# EasyEDA Pro project ProDoc_PCB1_2025-12-06.epro

# Board PCB1
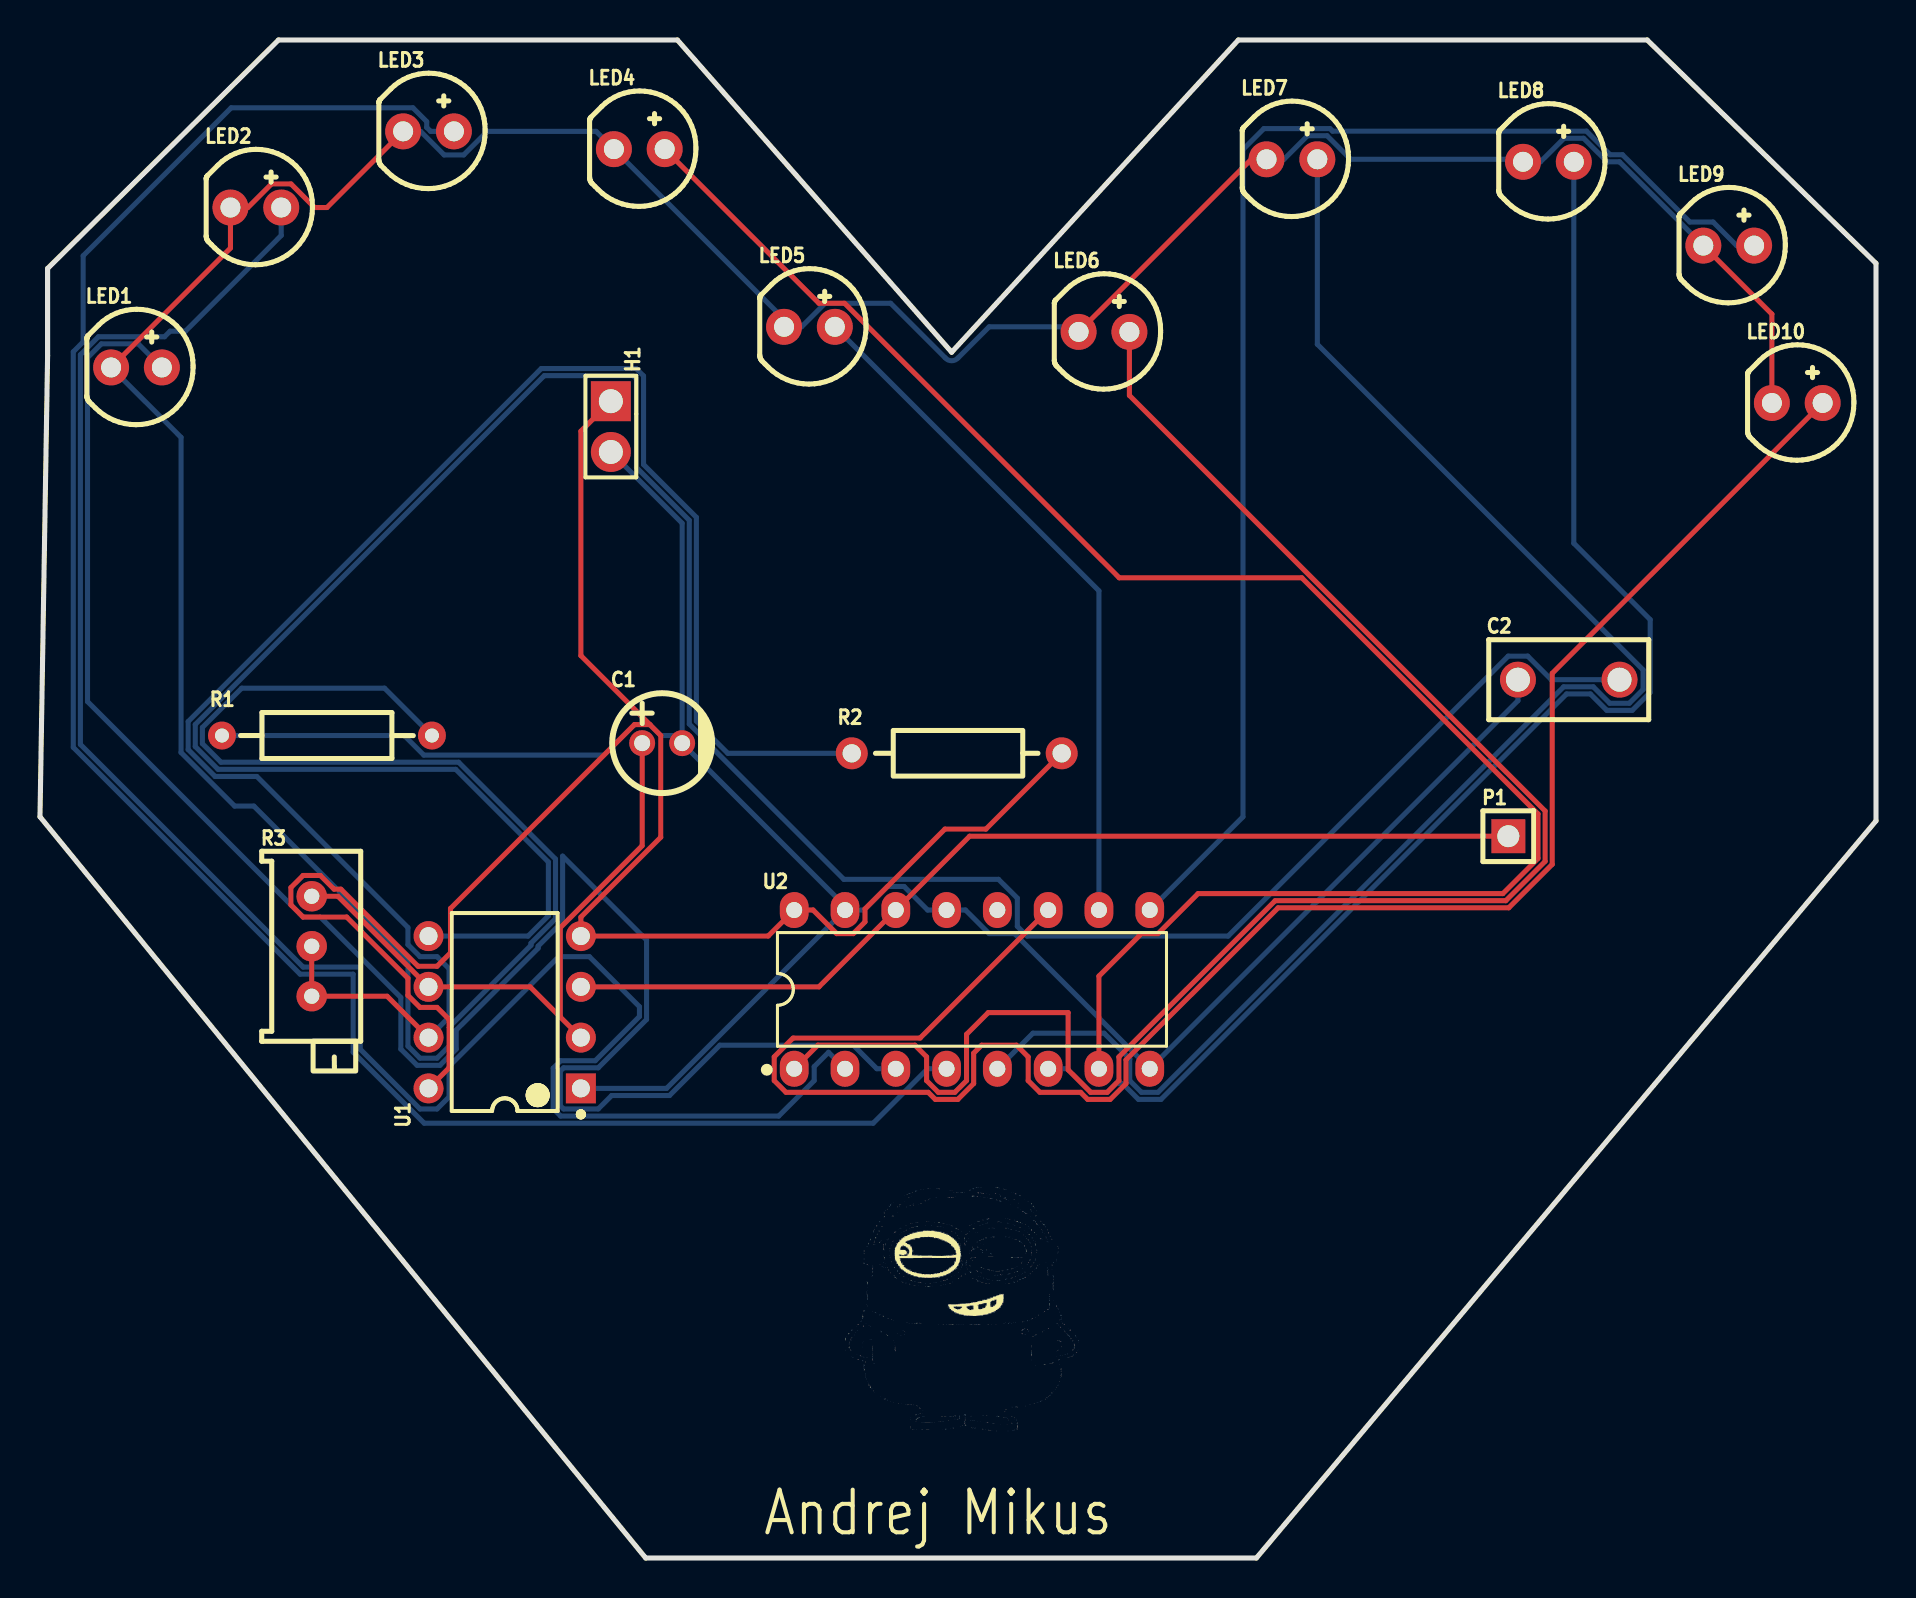
[diagram p0: board, top side]
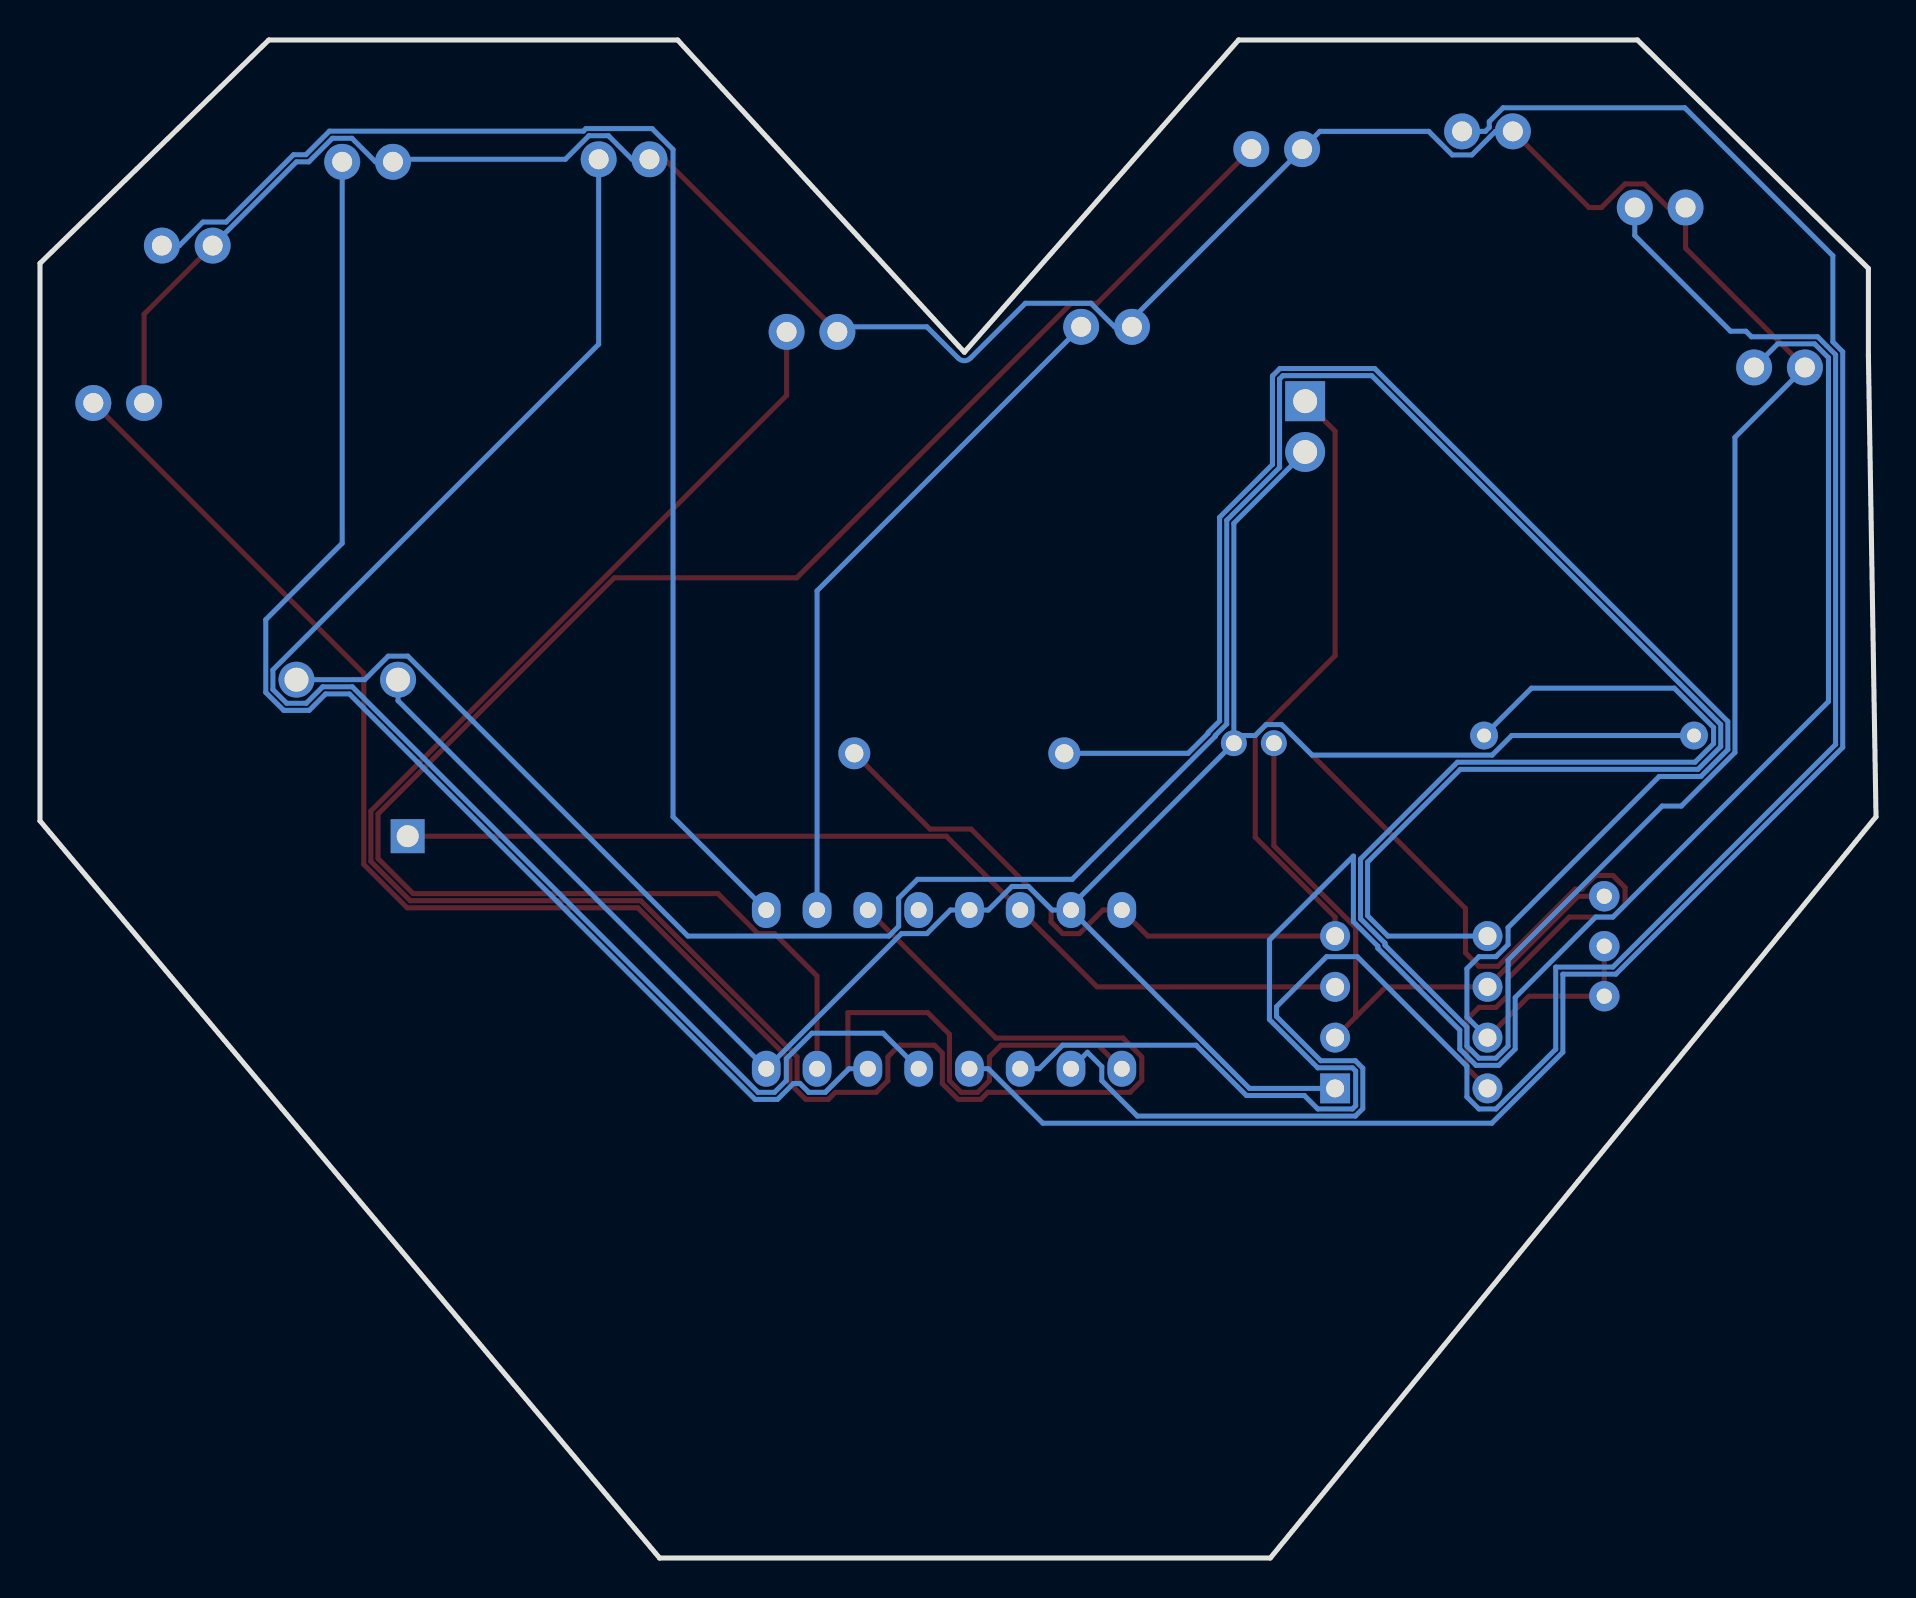
[diagram p1: board, bottom side, seen from below]

Outline 91.82 x 75.95 mm; copper layers: Top Layer, Bottom Layer. Coordinates in mm from the lower left corner of the outline.
Outline path: 0,37.08 30.29,0 60.83,0 91.82,36.88 91.82,64.77 80.38,75.95 59.93,75.95 45.59,60.33 31.88,75.95 11.93,75.95 0.38,64.52 0.38,60.16 0,37.08
Stack: Top Layer 0.035mm / Dielectric1 1.51mm FR4 er 4.5 / Bottom Layer 0.035mm

## Design rules (mm)
template: JLCPCB Capability(Two Layers Board)
spacing copperThickness1oz (default): track to track 0.102, other pairs 0.152 to 0.3
spacing copperThickness2oz: track to track 0.203, other pairs 0.152 to 0.3
track width copperThickness1oz (default): min 0.127, default 0.254, max 2.54
track width copperThickness2oz: min 0.203, default 0.254, max 2.54
differential pair differentialPair (default): width min 0.127, default 0.254, max 2.54; gap min 0.152, default 0.152
via viaSize (default): diameter min 0.5, default 0.61, max 10; hole min 0.3, default 0.305, max 6.3

## Placement (name value [footprint] x y rotation side)
C1  1uF  [CAP-TH_BD5.0-P2.00-D0.8-FD]  31.11 40.77 0 top
C2  10nF  [CAP-TH_L8.0-W4.0-P5.00-D1.2]  76.45 43.94 0 top
H1  PZ254V-11-02P  [HDR-TH_2P-P2.54-V-M]  28.55 56.6 270 top
LED1  LED1  [LED-TH_BD5.9-P2.54-RD_WHITE]  4.83 59.56 0 top
LED2  LED2  [LED-TH_BD5.9-P2.54-RD_WHITE]  10.8 67.56 0 top
LED3  LED3  [LED-TH_BD5.9-P2.54-RD_WHITE]  19.43 71.37 0 top
LED4  LED4  [LED-TH_BD5.9-P2.54-RD_WHITE]  29.97 70.49 0 top
LED5  LED5  [LED-TH_BD5.9-P2.54-RD_WHITE]  38.48 61.6 0 top
LED6  LED6  [LED-TH_BD5.9-P2.54-RD_WHITE]  53.21 61.34 0 top
LED7  LED7  [LED-TH_BD5.9-P2.54-RD_WHITE]  62.61 69.98 0 top
LED8  LED8  [LED-TH_BD5.9-P2.54-RD_WHITE]  75.44 69.85 0 top
LED9  LED9  [LED-TH_BD5.9-P2.54-RD_WHITE]  84.45 65.66 0 top
LED10  LED10  [LED-TH_BD5.9-P2.54-RD_WHITE]  87.88 57.79 0 top
P1  2.54-1*1P针  [HDR-TH_1P-P2.54-V-M]  73.43 36.11 0 top
R1  1kΩ  [RES-TH_BD2.3-L6.5-P10.50-D0.5]  14.35 41.15 0 top
R2  470Ω  [RES-TH_BD2.2-L6.5-P10.50-D0.6]  45.85 40.26 0 top
R3  50kΩ  [RES-ADJ-TH_3P-L9.5-W4.85-P2.50-BL-L]  13.59 30.61 0 top
U1  NE555P  [DIP-8_L9.8-W6.6-P2.54-LS7.6-BL]  23.24 27.31 90 top
U2  CD4017BE(LX)  [PDIP-16_L19.3-W6.4-P2.54-LS7.94-BL]  46.61 28.45 0 top

## Footprints (pads in the part's own frame, mm; a bottom-side part is the same pattern mirrored in y, then rotated)
CAP-TH_BD5.0-P2.00-D0.8-FD
  round 1.3 hole 0.8: 1(-1,0) 2(1,0)
CAP-TH_L8.0-W4.0-P5.00-D1.2
  round 1.8 hole 1.2: 1(-2.54,0) 2(2.54,0)
DIP-8_L9.8-W6.6-P2.54-LS7.6-BL
  rect 1.5x1.5 hole 0.9: 1(-3.81,-3.81)
  round 1.5 hole 0.9: 2(-1.27,-3.81) 3(1.27,-3.81) 4(3.81,-3.81) 5(3.81,3.81) 6(1.27,3.81) 7(-1.27,3.81) 8(-3.81,3.81)
HDR-TH_1P-P2.54-V-M
  rect 1.7x1.7 hole 1.1: 1(0,0)
HDR-TH_2P-P2.54-V-M
  rect 2x2 hole 1.2: 1(-1.27,0)
  round 2 hole 1.2: 2(1.27,0)
LED-TH_BD5.9-P2.54-RD_WHITE
  round 1.8 hole 1: 1(-1.27,0) 2(1.27,0)
PDIP-16_L19.3-W6.4-P2.54-LS7.94-BL
  oval 1.44x1.8 hole 0.8: 1(-8.89,-3.97) 2(-6.35,-3.97) 3(-3.81,-3.97) 4(-1.27,-3.97) 5(1.27,-3.97) 6(3.81,-3.97) 7(6.35,-3.97) 8(8.89,-3.97) 9(8.89,3.97) 10(6.35,3.97) 11(3.81,3.97) 12(1.27,3.97) 13(-1.27,3.97) 14(-3.81,3.97) 15(-6.35,3.97) 16(-8.89,3.97)
RES-ADJ-TH_3P-L9.5-W4.85-P2.50-BL-L
  round 1.524 hole 0.762: 1(0,2.5) 2(0,0) 3(0,-2.5)
RES-TH_BD2.2-L6.5-P10.50-D0.6
  round 1.6 hole 0.914: 1(-5.25,0) 2(5.25,0)
RES-TH_BD2.3-L6.5-P10.50-D0.5
  round 1.4 hole 0.7: 1(-5.25,0) 2(5.25,0)

## Nets
$1N1415: LED1.2 U2.3
$1N1443: LED2.2 U2.2
$1N1452: LED3.2 U2.4
$1N1462: LED4.2 U2.7
$1N1469: LED5.2 U2.10
$1N1474: LED6.2 U2.1
$1N1481: LED7.2 U2.5
$1N1488: LED8.2 U2.6
$1N1495: LED9.2 U2.9
$1N1502: LED10.2 U2.11
$1N1515: LED1.1 LED2.1 LED3.1 LED4.1 LED5.1 LED6.1 LED7.1 LED8.1 LED9.1 LED10.1 R1.2
$1N1669: H1.1 R2.2 U1.4 U1.8 U2.16
$1N1753: R2.1 R3.2 R3.3 U1.7
$1N1808: C1.1 R3.1 U1.2 U1.6
$1N1830: C2.2 U1.5
$1N2211: C1.2 C2.1 H1.2 R1.1 U1.1 U2.8 U2.13 U2.15
$1N2219: P1.1 U1.3 U2.14

Pads without a net: U2 12

## Routing (per net, layer and track width the routed paths; a pad name or vN(x,y) marks a point on that pad's centre or on a via; arc(x,y) is an arc through that point)
$1N1415: length 97.1
  Bottom Layer w0.254: LED1.2 4.92,60.74 3.07,60.74 2.38,60.05 2.38,42.85 13.16,32.07 14.02,32.07 18.05,28.04 18.05,25.46 18.86,24.65 20,24.65 20.82,25.46 20.82,26.41 24.91,30.51 24.91,30.61 26.14,31.84 26.14,35.12 30.33,30.92 30.33,26.94 27.92,24.52 26.19,24.52 26.02,24.36 26.02,22.63 26.19,22.47 27.92,22.47 28.59,23.14 31.48,23.14 34,25.66 40.67,25.66 41.85,24.48 U2.3
$1N1443: length 101.1
  Bottom Layer w0.254: LED2.2 12.06,66.17 7.28,61.38 6.51,61.38 6.23,61.1 2.92,61.1 2.02,60.2 2.02,40.7 13.16,29.57 16.02,29.57 16.02,25.45 19.01,22.47 19.86,22.47 20.46,23.07 20.46,24.6 25.94,30.09 27.48,30.09 29.98,27.58 29.98,27.09 27.77,24.88 26.04,24.88 25.67,24.51 25.67,22.48 26.04,22.11 36.94,22.11 38.72,23.88 38.72,24.58 39.44,25.3 U2.2
$1N1452: length 101.9
  Bottom Layer w0.254: LED3.2 19.54,71.37 19.34,71.57 19.34,71.86 18.65,72.55 9.56,72.55 2.16,65.15 2.16,60.84 1.67,60.35 1.67,40.56 13.01,29.21 15.66,29.21 15.66,25.31 19.21,21.75 41.67,21.75 44.39,24.48 45.34,24.48
$1N1462: length 88.7
  Top Layer w0.254: U2.7 52.96,29.11 55.08,31.24 55.91,31.24 57.92,33.24 73.16,33.24 74.92,35 74.92,37.23 63.1,49.04 53.98,49.04 40.24,62.77 38.95,62.77 LED4.2
$1N1469: length 34.6
  Bottom Layer w0.254: U2.10 52.96,48.39 LED5.2
$1N1474: length 86.6
  Top Layer w0.254: 37.72,24.48 38.9,25.66 43.76,25.66 44.34,25.07 44.34,23.88 44.92,23.3 45.75,23.3 46.34,23.88 46.34,26.2 47.42,27.29 51.42,27.29 51.42,24.43 52.55,23.3 53.37,23.3 53.96,23.88 53.96,25.07 61.77,32.89 73.31,32.89 75.27,34.85 75.27,37.37 54.48,58.16 LED6.2
$1N1481: length 77.2
  Bottom Layer w0.254: U2.5 49.66,26.26 53.22,26.26 54.5,24.97 54.5,23.88 55.08,23.3 55.91,23.3 76.2,43.59 77.68,43.59 78.51,42.76 79.48,42.76 80.17,43.45 80.17,44.43 63.88,60.72 LED7.2
$1N1488: length 68.4
  Bottom Layer w0.254: U2.6 51.37,24.48 52.55,23.3 53.37,23.3 53.81,23.74 54.14,23.74 54.94,22.94 56.06,22.94 76.35,43.23 77.54,43.23 78.36,42.41 79.63,42.41 80.53,43.31 80.53,46.95 76.71,50.77 LED8.2
$1N1495: length 68.4
  Bottom Layer w0.254: U2.9 60.16,37.08 60.16,70.47 61.21,71.51 64.52,71.51 64.64,71.39 77.34,71.39 78.52,70.21 79.14,70.21 82.51,66.84 83.67,66.84 84.85,65.66 LED9.2
$1N1502: length 95.3
  Top Layer w0.254: U2.11 44.01,26.01 37.66,26.01 36.72,25.07 36.72,23.88 37.3,23.3 44.42,23.3 44.78,22.94 45.9,22.94 46.69,23.74 46.69,25.26 47.09,25.66 48.83,25.66 49.42,25.07 49.42,23.88 50.01,23.3 52.04,23.3 52.4,22.94 53.52,22.94 54.31,23.74 54.31,24.92 61.92,32.53 73.45,32.53 75.63,34.7 75.63,44.26 LED10.2
$1N1515: length 199.9
  Top Layer w0.254: LED3.1 14.35,67.56 13.73,67.56 12.55,68.74 11.58,68.74 10.4,67.56 LED2.1 9.53,65.53 LED1.1 ; LED7.1 60.58,69.98 LED6.1 ; LED10.1 86.61,62.23 LED9.1
  Bottom Layer w0.254: LED3.1 19.03,71.37 20.21,70.2 21.19,70.2 22.37,71.37 27.81,71.37 LED4.1 37.21,61.98 LED5.1 38.08,61.6 39.26,62.77 42.54,62.77 45.27,60.04 arc(45.59,59.9) 45.91,60.04 47.47,61.6 51.69,61.6 LED6.1 ; LED9.1 78.99,69.85 78.38,69.85 77.2,71.03 76.22,71.03 75.04,69.85 LED8.1 74.04,69.98 65.55,69.98 64.37,71.16 63.39,71.16 62.21,69.98 LED7.1 ; R1.2 17.23,43.52 10.09,43.52 8.12,41.55 8.12,40.74 9.05,39.81 20.94,39.81 25.78,34.97 25.78,31.98 24.56,30.76 24.56,30.66 20.46,26.56 20.46,25.61 19.86,25.01 19.01,25.01 18.4,25.61 18.4,29.91 10.7,37.62 9.73,37.62 7.05,40.3 7.05,56.07 LED1.1
$1N1669: length 101.8
  Top Layer w0.254: 30.5,41.7 31.04,41.15 31.04,36.06 27.05,32.07 U1.4 36.42,31.12 37.72,32.42 38.67,32.42 39.85,31.24 40.67,31.24 41.26,31.82 41.26,32.47 45.26,36.47 47.31,36.47 R2.2 ; 30.5,41.7 27.05,45.15 27.05,56.38 H1.1 ; 30.5,41.7 29.73,41.7 20.53,32.5 20.53,30.28 19.86,29.6 18.91,29.6 15.05,33.46 14.7,33.46 14.02,34.15 13.16,34.15 12.55,33.54 12.55,32.68 13.16,32.07 15.34,32.07 18.4,29 18.4,28.15 19.01,27.55 19.86,27.55 20.46,26.94 20.46,24.52 U1.8
$1N1753: length 89.6
  Top Layer w0.254: U1.7 17.36,28.11 R3.3 R3.2
  Bottom Layer w0.254: R2.1 34.4,40.26 33.4,41.26 33.4,41.3 32.83,41.87 32.83,52.06 30.18,54.71 30.18,59.14 29.81,59.51 25.07,59.51 7.41,41.85 7.41,40.45 8.76,39.1 10.84,39.1 18.4,31.54 18.4,30.69 19.01,30.09 19.86,30.09 20.46,29.48 20.46,27.06 U1.7
$1N1808: length 31.8
  Top Layer w0.254: R3.1 14.9,33.11 U1.6 24.51,28.58 26.02,27.06 ; C1.1 30.11,35.63 26.02,31.54 26.02,27.06 ; 26.02,27.06 U1.2
$1N1830: length 136
  Bottom Layer w0.254: C2.2 75.58,43.94 74.4,45.12 73.43,45.12 59.42,31.12 49.37,31.12 48.88,31.6 48.88,33.01 47.94,33.95 40.2,33.95 33.04,41.11 33.04,41.15 32.47,41.73 32.47,51.92 29.83,54.56 29.83,58.99 29.67,59.15 25.22,59.15 7.77,41.7 7.77,40.6 8.9,39.46 20.79,39.46 25.42,34.82 25.42,32.13 24.41,31.12 U1.5
$1N2211: length 115.6
  Bottom Layer w0.254: 32.11,41 31.97,41.15 31.05,41.15 30.5,41.7 29.73,41.7 28.2,40.17 19.2,40.17 18.22,41.15 R1.1 ; 32.11,41 32.11,51.77 H1.2 ; 32.11,41 C1.2 40.26,32.62 U2.15 ; U2.15 31.34,23.5 U1.1 ; U2.15 41.21,32.42 42.39,33.6 43.21,33.6 44.39,32.42 46.29,32.42 47.46,31.24 48.74,31.24 U2.8 73.91,42.89 C2.1
$1N2219: length 49.5
  Top Layer w0.254: U1.3 38.96,28.58 U2.14 46.49,36.11 P1.1

## Text on the board
Top Silkscreen Layer: Andrej Mikus
